# Altium project D8B-三锂电65W充电节.PrjPcb
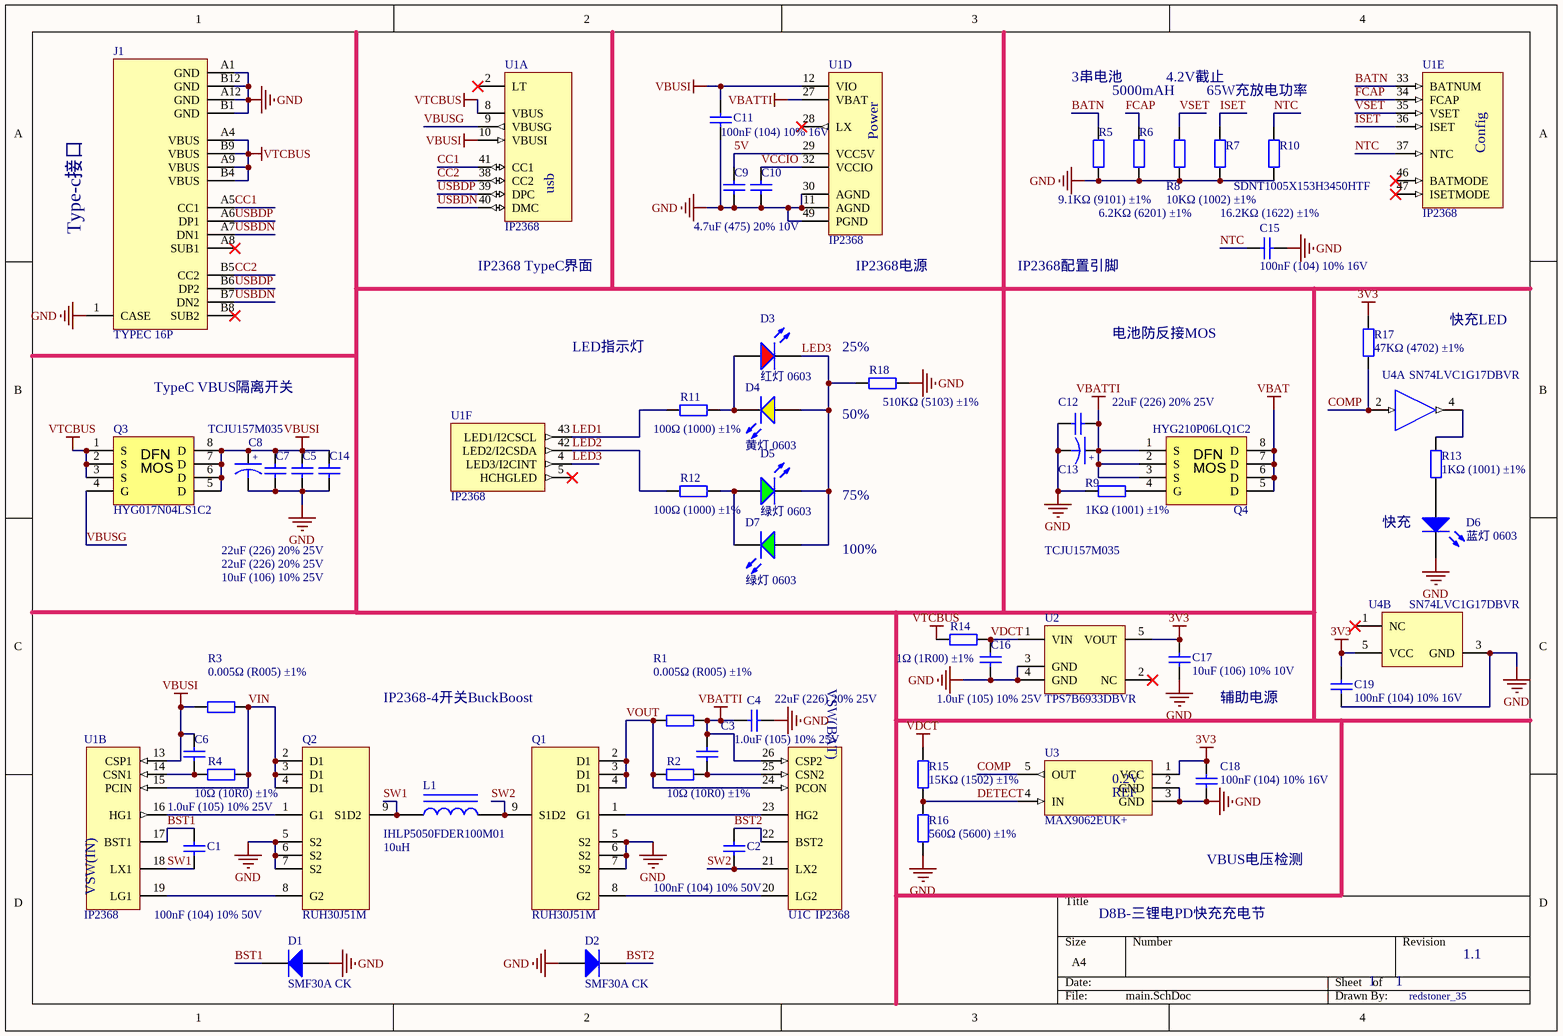
[diagram p0: main.SchDoc]
1 sheet, 54 parts. Net scope: global (net labels, ports and power ports of the same name join across sheets).
Board file: PCB1.PcbDoc

## Sheet main.SchDoc
size A4

### Parts
C1  100nF (104) 10% 50V  [0603_C]
C2  100nF (104) 10% 50V  [0603_C]
C3  1.0uF (105) 10% 25V  [0402_C]
C4  22uF (226) 20% 25V  [0805_C]
C5  22uF (226) 20% 25V  [0805_C]
C6  1.0uF (105) 10% 25V  [0402_C]
C7  22uF (226) 20% 25V  [0805_C]
C8  TCJU157M035  [CAPMP7362X41N]
C9  4.7uF (475) 20% 10V  [0402_C]
C10  4.7uF (475) 20% 10V  [0402_C]  (value not drawn)
C11  100nF (104) 10% 16V  [0402_C]
C12  22uF (226) 20% 25V  [0805_C]
C13  TCJU157M035  [CAPMP7362X41N]
C14  10uF (106) 10% 25V  [0805_C]
C15  100nF (104) 10% 16V  [0402_C]
C16  1.0uF (105) 10% 25V  [0402_C]
C17  10uF (106) 10% 10V  [0603_C]
C18  100nF (104) 10% 16V  [0402_C]
C19  100nF (104) 10% 16V  [0402_C]
D1  SMF30A CK  [SOD-123]
D2  SMF30A CK  [SOD-123]
D3  红灯 0603  [0603_LED_S1]
D4  黄灯 0603  [0603_LED_S1]
D5  绿灯 0603  [0603_LED_S1]
D6  蓝灯 0603  [0603_LED_S1]
D7  绿灯 0603  [0603_LED_S1]
J1  TYPEC 16P  [USB-C-SMD_KH-TYPE-C-16P]
L1  IHLP5050FDER100M01  value 10uH  [IHLP5050FDER***M01]
Q1  RUH30J51M  [PDFN-8_L5.8-W4.9_RU30J30M]
Q2  RUH30J51M  [PDFN-8_L5.8-W4.9_RU30J30M]
Q3  HYG017N04LS1C2  [SON/DFN5x6(MOS)]
Q4  HYG210P06LQ1C2  [SON/DFN5x6(MOS)]
R1  0.005Ω (R005) ±1%  [1206_R]
R2  10Ω (10R0) ±1%  [0402_R]
R3  0.005Ω (R005) ±1%  [1206_R]
R4  10Ω (10R0) ±1%  [0402_R]
R5  9.1KΩ (9101) ±1%  [0402_R]
R6  6.2KΩ (6201) ±1%  [0402_R]
R7  16.2KΩ (1622) ±1%  [0402_R]
R8  10KΩ (1002) ±1%  [0402_R]
R9  1KΩ (1001) ±1%  [0402_R]
R10  SDNT1005X153H3450HTF  [0402_R]
R11  100Ω (1000) ±1%  [0603_R]
R12  100Ω (1000) ±1%  [0603_R]
R13  1KΩ (1001) ±1%  [0603_R]
R14  1Ω (1R00) ±1%  [0402_R]
R15  15KΩ (1502) ±1%  [0402_R]
R16  560Ω (5600) ±1%  [0402_R]
R17  47KΩ (4702) ±1%  [0402_R]
R18  510KΩ (5103) ±1%  [0402_R]
U1  IP2368  [QFN50P700X700X100_HS-49M]  (parts A,B,C,D,E,F of 6)
U2  TPS7B6933DBVR  [SOT95P245X110-5N]
U3  MAX9062EUK+  [SOT95P245X110-5N]
U4  SN74LVC1G17DBVR  [DBV0005A_N]  (parts A,B of 2)

### Nets
3V3: C17.2 C18.2 C19.2 R17.2 U2.5(VOUT) U3.1(VCC) U4.5(VCC)
GND: C4.2 C5.1 C7.1 C8.2 C9.1 C10.1 C11.1 C12.2 C13.2 C14.1 C15.2 C16.1 C17.1 C18.1 C19.1 D1.1(A) D2.1(A) D6.K J1.1(CASE) J1.A1(GND) J1.A12(GND) J1.B1(GND) J1.B12(GND) Q1.5(S2) Q1.6(S2) Q1.7(S2) Q2.5(S2) Q2.6(S2) Q2.7(S2) R5.1 R6.1 R7.1 R8.1 R9.1 R10.1 R16.1 R18.2 U1.11(AGND) U1.30(AGND) U1.49(PGND) U2.3(GND) U2.4(GND) U3.2(GND) U3.3(GND) U4.3(GND)
VBAT: Q4.5(D) Q4.6(D) Q4.7(D) Q4.8(D)
VBATTI: C3.2 C4.1 C12.1 C13.1 Q4.1(S) Q4.2(S) Q4.3(S) R1.2 U1.26(CSP2) U1.27(VBAT)
VBUSI: C5.2 C6.2 C7.2 C8.1 C11.2 C14.2 Q3.5(D) Q3.6(D) Q3.7(D) Q3.8(D) R3.1 U1.10(VBUSI) U1.12(VIO) U1.13(CSP1)
VDCT: C16.2 R14.2 R15.2 U2.1(VIN)
VTCBUS: J1.A4(VBUS) J1.A9(VBUS) J1.B4(VBUS) J1.B9(VBUS) Q3.1(S) Q3.2(S) Q3.3(S) R14.1 U1.8(VBUS)
5V: C9.2 U1.29(VCC5V)
BATN: R5.2 U1.33(BATNUM)
BST1: C1.2 D1.2(K) U1.17(BST1)
BST2: C2.2 D2.2(K) U1.22(BST2)
CC1: J1.A5(CC1) U1.41(CC1)
CC2: J1.B5(CC2) U1.38(CC2)
COMP: R17.1 U3.5(OUT) U4.2(A)
DETECT: R15.1 R16.2 U3.4(IN)
FCAP: R6.2 U1.34(FCAP)
ISET: R7.2 U1.36(ISET)
LED1: R11.1 U1.43(LED1/I2CSCL)
LED2: R12.1 U1.42(LED2/I2CSDA)
LED3: D3.K D4.A D5.K D7.A R18.1 U1.4(LED3/I2CINT)
NTC: C15.1 R10.2 U1.37(NTC)
SW1: C1.1 L1.1 Q2.9(S1D2) U1.18(LX1)
SW2: C2.1 L1.2 Q1.9(S1D2) U1.21(LX2)
USBDN: J1.A7(DN1) J1.B7(DN2) U1.40(DMC)
USBDP: J1.A6(DP1) J1.B6(DP2) U1.39(DPC)
VBUSG: Q3.4(G) U1.9(VBUSG)
VCCIO: C10.2 U1.32(VCCIO)
VIN: Q2.2(D1) Q2.3(D1) Q2.4(D1) R3.2 R4.2 U1.15(PCIN)
VOUT: Q1.2(D1) Q1.3(D1) Q1.4(D1) R1.1 R2.1 U1.24(PCON)
VSET: R8.2 U1.35(VSET)
NetC3_1: C3.1 R2.2 U1.25(CSN2)
NetC6_1: C6.1 R4.1 U1.14(CSN1)
NetD3_A: D3.A D4.K R11.2
NetD5_A: D5.A D7.K R12.2
NetD6_A: D6.A R13.1
NetQ1_1: Q1.1(G1) U1.23(HG2)
NetQ1_8: Q1.8(G2) U1.20(LG2)
NetQ2_1: Q2.1(G1) U1.16(HG1)
NetQ2_8: Q2.8(G2) U1.19(LG1)
NetQ4_4: Q4.4(G) R9.2
NetR13_2: R13.2 U4.4(Y)

Not connected (* = marked no-connect by the designer): J1 A8(SUB1)* B8(SUB2)*; U1 2(LT)* 5(HCHGLED)* 28(LX)* 46(BATMODE)* 47(ISETMODE)*; U2 2(NC)*; U4 1(NC)*

### Notes on the sheet
- 3串电池
- 5000mAH
- 4.2V截止
- 65W充放电功率
- (near J1) Type-c接口
- (near U1) IP2368 TypeC界面
- (near U1) IP2368电源
- IP2368配置引脚
- LED指示灯
- (near R18) 25%
- 电池防反接MOS
- 快充LED
- TypeC VBUS隔离开关
- (near R18) 50%
- 75%
- 100%
- 快充
- IP2368-4开关BuckBoost
- 辅助电源
- D8B-三锂电PD快充充电节
- VBUS电压检测
- 1
- 1.1
- redstoner_35
- (in symbol CAP2) +
- (in symbol IP2368, part A) usb
- (in symbol IP2368, part B) VSW(IN)
- (in symbol IP2368, part C) VSW(BAT)
- (in symbol IP2368, part D) Power
- (in symbol IP2368, part E) Config
- (in symbol MAX9062) 0.2V; REF

### Library data of the parts
C1 C2 = 0603 100nF (104) 10% 50V: 贴片电容; ComponentLink1Description: 供应商链接; ComponentLink1URL: http://www.szlcsc.com/product/details_15331.html; Package: 0603; Supplier: LC; SuppliersPartNumber: C14663
C3 C6 C16 = 0402 1.0uF (105) 10% 25V: 贴片电容; ComponentLink1Description: 供应商链接; ComponentLink1URL: http://www.szlcsc.com/product/details_53938.html; Package: 0402; Supplier: LC; SuppliersPartNumber: C52923
C4 C5 C7 C12 = 0805 22uF (226) 20% 25V: 贴片电容; ComponentLink1Description: 供应商链接; ComponentLink1URL: http://www.szlcsc.com/product/details_46786.html; Package: 0805; Supplier: LC; SuppliersPartNumber: C45783
C8 C13 = CAP2: Capacitor
C9 C10 = 0402 4.7uF (475) 20% 10V: 贴片电容; ComponentLink1Description: 供应商链接; ComponentLink1URL: http://www.szlcsc.com/product/details_24469.html; Package: 0402; Supplier: LC; SuppliersPartNumber: C23733
C11 C15 C18 C19 = 0402 100nF (104) 10% 16V: 贴片电容; ComponentLink1Description: 供应商链接; ComponentLink1URL: http://www.szlcsc.com/product/details_1877.html; Package: 0402; Supplier: LC; SuppliersPartNumber: C1525
C14 = 0805 10uF (106) 10% 25V: 贴片电容; ComponentLink1Description: 供应商链接; ComponentLink1URL: http://www.szlcsc.com/product/details_16532.html; Package: 0805; Supplier: LC; SuppliersPartNumber: C15850
C17 = 0603 10uF (106) 10% 10V: 贴片电容; ComponentLink1Description: 供应商链接; ComponentLink1URL: http://www.szlcsc.com/product/details_20411.html; Package: 0603; Supplier: LC; SuppliersPartNumber: C19702
D1 D2 = SOD-123 B5819W  SL: TVS二极管; ComponentLink1Description: 供应商链接; ComponentLink1URL: http://www.szlcsc.com/product/details_9093.html; Package: SOD-123; Supplier: LC; SuppliersPartNumber: C??????
D3 = 0603 红灯: 发光二极管; ComponentLink1Description: 供应商链接; ComponentLink1URL: http://www.szlcsc.com/product/details_2659.html; Package: 0603; Supplier: LC; SuppliersPartNumber: C2286
D4 = 0603 黄灯: 发光二极管; ComponentLink1Description: 供应商链接; ComponentLink1URL: http://www.szlcsc.com/product/details_73147.html; Package: 0603; Supplier: LC; SuppliersPartNumber: C72038
D5 D7 = 0603 绿灯: 发光二极管; ComponentLink1Description: 供应商链接; ComponentLink1URL: http://www.szlcsc.com/product/details_73152.html; Package: 0603; Supplier: LC; SuppliersPartNumber: C72043
D6 = 0603 蓝灯: 发光二极管; ComponentLink1Description: 供应商链接; ComponentLink1URL: http://www.szlcsc.com/product/details_73150.html; Package: 0603; Supplier: LC; SuppliersPartNumber: C72041
J1 = KH-TYPEC-16P: 16Pin TypeC立贴座子
L1 = Inductor Iron: Vishay Inductor 10uH 16.4mR 15.5A; Published: 24-Mar-1999; LatestRevisionDate: 17-Jul-2002; LatestRevisionNote: Re-released for DXP Platform.; PackageReference: AXIAL-0.9; Publisher: Altium Limited; PackageDescription: Axial Device, Thru-Hole; 2 Leads; 0.9 in Pin Spacing
Q1 Q2 = RU30J30M: Dual N MOSFET 30V/51A
Q3 = SON/DFN5x6 MOS: 40V 1.7mΩ N Channel MOSFET
Q4 = SON/DFN5x6 MOS: P Channel MOSFET -60V -40A 25mΩ
R1 R3 = 1206 0Ω (0R0) 1%: 贴片电阻; ComponentLink1Description: 供应商链接; ComponentLink1URL: http://www.szlcsc.com/product/details_18576.html; Package: 1206; Supplier: LC
  R1: SuppliersPartNumber: C????????
  R3: SuppliersPartNumber: C???????
R2 R4 = 0402 10Ω (10R0) 1%: 贴片电阻; ComponentLink1Description: 供应商链接; ComponentLink1URL: http://www.szlcsc.com/product/details_25820.html; Package: 0402; Supplier: LC; SuppliersPartNumber: C25077
R5 R6 = 0402 0Ω (0R0) 1%: 贴片电阻; ComponentLink1Description: 供应商链接; ComponentLink1URL: http://www.szlcsc.com/product/details_17853.html; Package: 0402; Supplier: LC; SuppliersPartNumber: C17168
R7 R15 = 0402 15KΩ (1502) 1%: 贴片电阻; ComponentLink1Description: 供应商链接; ComponentLink1URL: http://www.szlcsc.com/product/details_26499.html; Package: 0402; Supplier: LC
  R7: SuppliersPartNumber: C??????????
  R15: SuppliersPartNumber: C25756
R8 = 0402 10KΩ (1002) 1%: 贴片电阻; ComponentLink1Description: 供应商链接; ComponentLink1URL: http://www.szlcsc.com/product/details_26487.html; Package: 0402; Supplier: LC; SuppliersPartNumber: C25744
R9 = 0402 1KΩ (1001) 1%: 贴片电阻; ComponentLink1Description: 供应商链接; ComponentLink1URL: http://www.szlcsc.com/product/details_12256.html; Package: 0402; Supplier: LC; SuppliersPartNumber: C11702
R10 = 0402 10KΩ (1002) 1%: 贴片NTC热敏电阻; B值: 3450; 阻值: 15KΩ; ComponentLink1Description: 供应商链接; ComponentLink1URL: http://www.szlcsc.com/product/details_26487.html; Package: 0402; Supplier: LC; SuppliersPartNumber: C???????????
R11 R12 = 0603 100Ω (1000) 1%: 贴片电阻; ComponentLink1Description: 供应商链接; ComponentLink1URL: http://www.szlcsc.com/product/details_23502.html; Package: 0603; Supplier: LC; SuppliersPartNumber: C22775
R13 = 0603 1KΩ (1001) 1%: 贴片电阻; ComponentLink1Description: 供应商链接; ComponentLink1URL: http://www.szlcsc.com/product/details_21904.html; Package: 0603; Supplier: LC; SuppliersPartNumber: C21190
R14 = 0402 1Ω (1R00) 1%: 贴片电阻; ComponentLink1Description: 供应商链接; ComponentLink1URL: http://www.szlcsc.com/product/details_25829.html; Package: 0402; Supplier: LC; SuppliersPartNumber: C25086
R16 = 0402 510Ω (5100) 1%: 贴片电阻; ComponentLink1Description: 供应商链接; ComponentLink1URL: http://www.szlcsc.com/product/details_25866.html; Package: 0402; Supplier: LC; SuppliersPartNumber: C???????
R17 = 0402 47KΩ (4702) 1%: 贴片电阻; ComponentLink1Description: 供应商链接; ComponentLink1URL: http://www.szlcsc.com/product/details_26535.html; Package: 0402; Supplier: LC; SuppliersPartNumber: C25792
R18 = 0402 510KΩ (5103) 1%: 贴片电阻; ComponentLink1Description: 供应商链接; ComponentLink1URL: http://www.szlcsc.com/product/details_12170.html; Package: 0402; Supplier: LC; SuppliersPartNumber: C11616
U1 = IP2368: IP2368 2-5S 双向电池充放电管理，100W PD
U2 = TPS7B6933DBVR: 150mA 40V max input Ultra low Iq LDO,fixed 3.3V output
U3 = MAX9062: tiny Comparator with 0.2V Ref OD Output
U4 = SN74LVC1G17DBVR: Single Schmitt-Trigger Buffer, DBV0005A, LARGE T&R; Manufacturer: Texas Instruments; VCC(Min)(V): 1.65; VCC(Max)(V): 5.5; Output Type: CMOS; ICC @ Nom Voltage(Max)(mA): 0.01; Input Type: CMOS/TTL; Bits(#): 1; F @ Nom Voltage(Max)(Mhz): 150; Rating: Catalog; Technology Family: LVC; Voltage(Nom)(V): 1.8,2.5,3.3,5; Schmitt Trigger: Yes; Output Drive (IOL/IOH)(Max)(mA): 32/-32; tpd @ Nom Voltage(Max)(ns): 11,6.5,5.5,5; Logic: True; Sub-Family: Non-Inverting Buffer/Driver; 3-State Output: No; DatasheetVersion: SCES351V; PackageReference: DBV0005A; Supplier 1: Mouser; Supplier Part Number 1: 595-SN74LVC1G17DBVR; Supplier 2: Digi-Key; Supplier Part Number 2: 296-11933-2-ND; Supplier 3: Digi-Key; Supplier Part Number 3: 296-11933-1-ND; Supplier 4: Digi-Key; Supplier Part Number 4: 296-11933-6-ND; Generic Part Number: SN74LVC1G17; Operating Temperature Range(C): -40 to 125,-40 to 85; PartNumber: SN74LVC1G17DBVR; ComponentLink1Description: Manufacturer URL; ComponentLink1URL: http://www.ti.com/; ComponentLink2Description: Datasheet; ComponentLink2URL: http://www.ti.com/lit/ds/symlink/sn74lvc1g17.pdf